# EAGLE design tec_controller (EAGLE 8.5.2)
CREV: 1.0
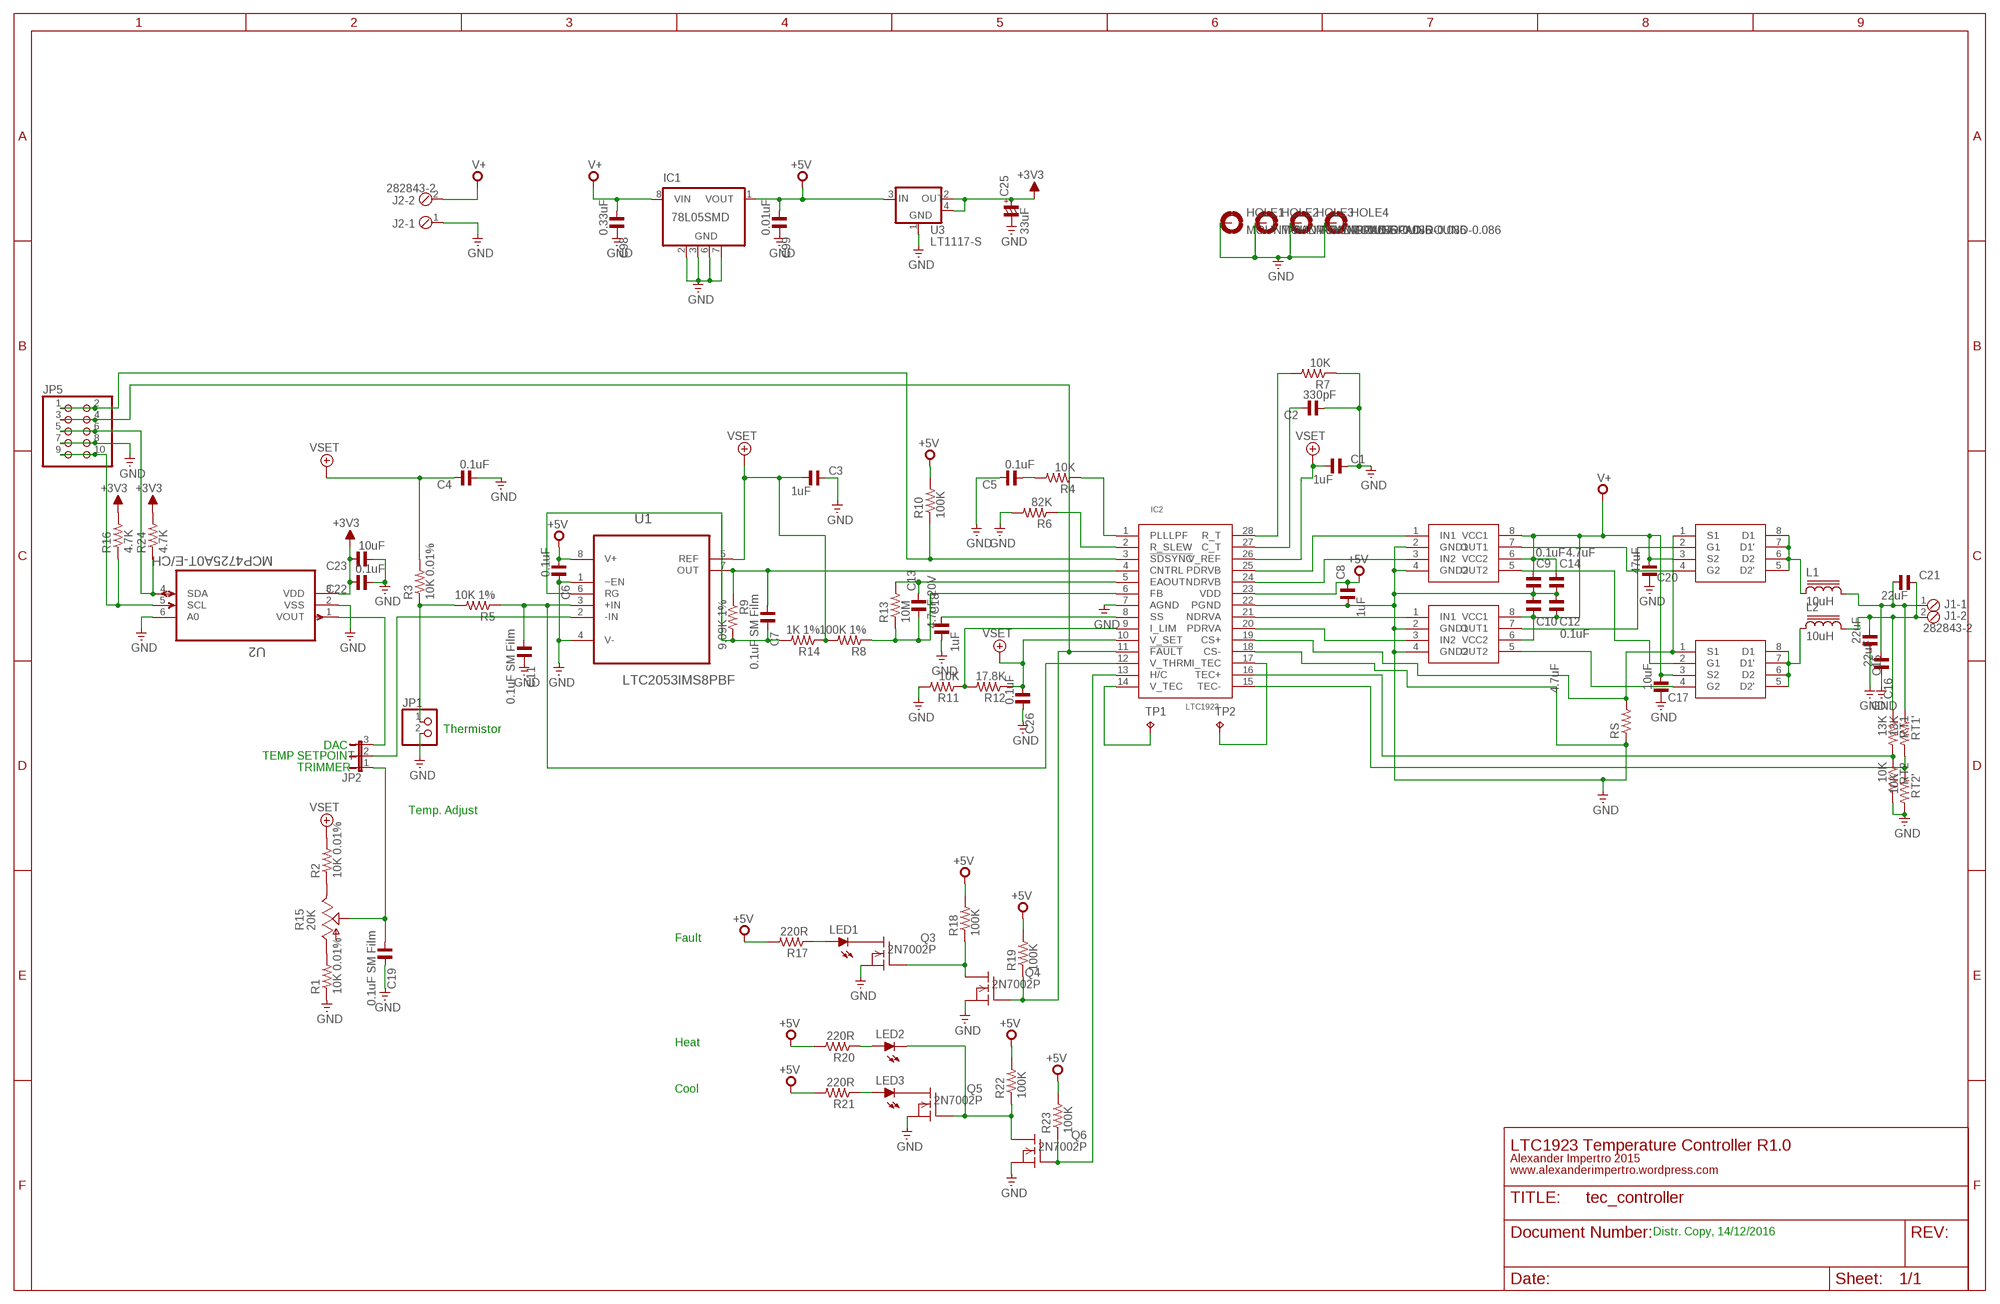
[diagram p0: schematic, sheet 1]
FRAME3 (FRAME_B_L): CREV: 1.0

## Parts
C1  1uF  C-EUC0603  [C0603]
C2  330pF  C-EUC0603  [C0603]
C3  1uF  C-EUC0603  [C0603]
C4  0.1uF  C-EUC0603  [C0603]
C5  0.1uF  C-EUC0603  [C0603]
C6  0.1uF  C-EUC0603  [C0603]
C7  0.1uF SM Film  C-EUC0805  [C0805]
C8  1uF  C-EUC0603  [C0603]
C9  0.1uF  C-EUC0603  [C0603]
C10  4.7uF  C-EUC0603  [C0603]
C11  0.1uF SM Film  C-EUC0805  [C0805]
C12  0.1uF  C-EUC0603  [C0603]
C13  4.7uF 20V  C-EUC1206  [C1206]
C14  4.7uF  C-EUC0603  [C0603]
C15  22uF  C-EUC0603  [C0603]
C16  22uF  C-EUC0603  [C0603]
C17  10uF  C-EUC0603  [C0603]
C18  1uF  C-EUC0603  [C0603]
C19  0.1uF SM Film  C-EUC0805  [C0805]
C20  47uF  C-EUC0805  [C0805]
C21  22uF  C-EUC0603  [C0603]
C22  0.1uF  C-EUC0603  [C0603]
C23  10uF  C-EUC0603  [C0603]
C25  33uF  CPOL-EU153CLV-0505  [153CLV-0505]
C26  0.1uF  C-EUC0603  [C0603]
C98  0.33uF  C-EUC0805  [C0805]
C99  0.01uF  C-EUC0805  [C0805]
HOLE1  MOUNT-PAD-ROUND-0.086  [086-PAD]
HOLE2  MOUNT-PAD-ROUND-0.086  [086-PAD]
HOLE3  MOUNT-PAD-ROUND-0.086  [086-PAD]
HOLE4  MOUNT-PAD-ROUND-0.086  [086-PAD]
IC1  78L05SMD  [SO08]
IC2  LTC1923  [SSOP28]
IC3  LTC1693-1  [SO-08]
IC4  LTC1693-1  [SO-08]
IC5  IRF7343  [SO-08]
IC6  IRF7343  [SO-08]
J1  282843-2  [282843-2]
J2  282843-2  [282843-2]
JP1  PINHD-1X2  [1X02]
JP2  JP2E  [JP2]
JP5  PINHD-2X5  [2X05]
L1  10uH  DRA127  [DRA127]
L2  10uH  DRA127  [DRA127]
LED1  LEDCHIPLED_0805  [CHIPLED_0805]
LED2  LEDCHIPLED_0805  [CHIPLED_0805]
LED3  LEDCHIPLED_0805  [CHIPLED_0805]
Q3  2N7002P  [SOT95P230X110-3N]
Q4  2N7002P  [SOT95P230X110-3N]
Q5  2N7002P  [SOT95P230X110-3N]
Q6  2N7002P  [SOT95P230X110-3N]
R1  10K 0.01%  R-EU_R0603  [R0603]
R2  10K 0.01%  R-EU_R0603  [R0603]
R3  10K 0.01%  R-EU_R0603  [R0603]
R4  10K  R-EU_R0603  [R0603]
R5  10K 1%  R-EU_R0603  [R0603]
R6  82K  R-EU_R0603  [R0603]
R7  10K  R-EU_R0603  [R0603]
R8  100K 1%  R-EU_R0603  [R0603]
R9  9.09K 1%  R-EU_R0603  [R0603]
R10  100K  R-EU_R0805  [R0805]
R11  10K  R-EU_R0603  [R0603]
R12  17.8K  R-EU_R0805  [R0805]
R13  10M  R-EU_R0805  [R0805]
R14  1K 1%  R-EU_R0603  [R0603]
R15  20K  TRIM_US-B25P  [B25P]
R16  4.7K  R-EU_R0603  [R0603]
R17  220R  R-EU_R0603  [R0603]
R18  100K  R-EU_R0603  [R0603]
R19  100K  R-EU_R0603  [R0603]
R20  220R  R-EU_R0603  [R0603]
R21  220R  R-EU_R0603  [R0603]
R22  100K  R-EU_R0603  [R0603]
R23  100K  R-EU_R0603  [R0603]
R24  4.7K  R-EU_R0603  [R0603]
RS  R-EU_R2512  [R2512]
RT1  13K  R-EU_R0603  [R0603]
RT1'  13K  R-EU_R0603  [R0603]
RT2  10K  R-EU_R0603  [R0603]
RT2'  10K  R-EU_R0603  [R0603]
TP1  TPTP10SQ  [TP10SQ]
TP2  TPTP10SQ  [TP10SQ]
U1  LTC2053IMS8PBF  [SOP65P490X110-8N]
U2  MCP4725A0T-E/CH  [SOT95P270X145-6N]
U3  LT1117-S  [SOT223]

## Nets
+3V3: C22.1 C23.1 C25.+ R16.2 R24.2 U2.3(VDD) U3.2(OUT) U3.4(TAB)
+5V: C6.2 C8.1 C99.2 IC1.1(VOUT) IC2.23(VDD) R10.2 R17.2 R18.2 R19.2 R20.2 R21.2 R22.2 R23.2 U1.8(V+) U3.3(IN)
+5V/2: C1.2 C3.2 C4.1 C26.2 IC2.10(V_SET) IC2.26(V_REF) R2.2 R3.2 R8.2 R12.1 R14.1 U1.5(REF) ; supply symbol labelled VSET
GND: C1.1 C2.2 C3.1 C4.2 C5.1 C6.1 C8.2 C9.1 C10.2 C11.1 C12.2 C14.1 C15.1 C16.1 C17.1 C18.2 C19.1 C20.1 C22.2 C23.2 C25.- C26.1 C98.1 C99.1 HOLE1.B086(MOUNT) HOLE2.B086(MOUNT) HOLE3.B086(MOUNT) HOLE4.B086(MOUNT) IC1.2(GND) IC1.3(GND) IC1.6(GND) IC1.7(GND) IC2.7(AGND) IC2.18(CS-) IC2.22(PGND) IC3.2(GND1) IC3.4(GND2) IC4.2(GND1) IC4.4(GND2) J2.1 JP1.2 JP5.7 JP5.8 Q3.2(S) Q4.2(S) Q5.2(S) Q6.2(S) R1.1 R6.2 R7.1 R11.2 RS.1 RT2'.2 RT2.2 U1.1(~EN) U1.4(V-) U2.2(VSS) U2.6(A0) U3.1(GND)
N$1: LED2.C Q5.1(G) Q6.3(D) R22.1
N$2: C2.1 IC2.27(C_T)
N$3: IC2.14(V_TEC) TP1.TP
N$4: IC2.17(I_TEC) TP2.TP
N$5: IC2.13(H/C) Q6.1(G) R23.1
N$6: IC2.28(R_T) R7.2
N$7: LED3.C Q5.3(D)
N$8: LED2.A R20.1
N$9: LED3.A R21.1
N$10: IC2.11(!FAULT) JP5.3 JP5.4 Q4.1(G) R19.1
N$11: Q3.1(G) Q4.3(D) R18.1
N$12: LED1.C Q3.3(D)
N$13: LED1.A R17.1
N$14: C7.2 IC2.4(CNTRL) R9.1 U1.7(OUT)
N$15: C11.2 IC2.12(V_THRM) R5.1 U1.3(+IN)
N$16: JP1.1 R3.1 R5.2
N$17: C7.1 R9.2 R14.2 U1.6(RG)
N$18: JP2.2 U1.2(-IN)
N$19: R1.2 R15.A
N$20: R2.1 R15.E
N$21: IC2.9(I_LIM) R11.1 R12.2
N$22: IC2.2(R_SLEW) R6.1
N$23: JP2.3 U2.1(VOUT)
N$24: C18.1 IC2.8(SS)
N$25: C5.2 R4.2
N$26: IC2.1(PLLLPF) R4.1
N$27: C13.2 IC2.6(FB) R8.1 R13.1
N$28: C13.1 IC2.5(EAOUT) R13.2
N$29: C19.2 JP2.1 R15.S
N$31: IC2.16(TEC+) RT1.2 RT2.1
N$32: IC2.25(PDRVB) IC3.1(IN1)
N$33: IC2.24(NDRVB) IC3.3(IN2)
N$34: IC2.21(NDRVA) IC4.1(IN1)
N$35: IC2.20(PDRVA) IC4.3(IN2)
N$36: IC2.15(TEC-) RT1'.2 RT2'.1
N$37: IC2.3(!SDSYNC) JP5.1 JP5.2 R10.1
N$39: IC2.19(CS+) IC5.1(S1) IC6.1(S1) RS.2
N$40: IC4.7(OUT1) IC5.2(G1)
N$42: IC3.7(OUT1) IC5.4(G2)
N$43: IC3.5(OUT2) IC6.2(G1)
N$44: C16.2 C21.2 J1.1 L1.2 RT1'.1
N$45: C15.2 C21.1 J1.2 L2.2 RT1.1
N$48: IC5.5(D2') IC5.6(D2) IC5.7(D1') IC5.8(D1) L1.1
N$49: IC6.5(D2') IC6.6(D2) IC6.7(D1') IC6.8(D1) L2.1
N$50: JP5.5 JP5.6 R24.1 U2.4(SDA)
N$51: JP5.9 JP5.10 R16.1 U2.5(SCL)
N$53: IC4.5(OUT2) IC6.4(G2)
V+: C9.2 C10.1 C12.1 C14.2 C17.2 C20.2 C98.2 IC1.8(VIN) IC3.6(VCC2) IC3.8(VCC1) IC4.6(VCC2) IC4.8(VCC1) IC5.3(S2) IC6.3(S2) J2.2
Unconnected: IC1.4(NC) IC1.5(NC)

## Notes on the sheet
- Thermistor
- DAC
- TEMP SETPOINT
- TRIMMER
- Temp. Adjust
- Fault
- Heat
- Cool
- LTC1923 Temperature Controller R1.0
- Alexander Impertro 2015
- www.alexanderimpertro.wordpress.com
- Distr. Copy, 14/12/2016

## Library data of the parts
C1-C23 C26 C98 C99 = rcl:C-EU: CAPACITOR, European symbol
C25 = rcl:CPOL-EU: POLARIZED CAPACITOR, European symbol
HOLE1-HOLE4 = holes:MOUNT-PAD-ROUND-: MOUNTING PAD, round; BOM: EXCLUDE
IC1 = linear:78L*SMD: Positive VOLTAGE REGULATOR
IC2 = LTC1923:LTC1923
IC3 IC4 = LTC1693-1:LTC1693-1
IC5 IC6 = IRF7343:IRF7343
J1 J2 = con-tyco:282843-2: TERMINAL BLOCK Buchanan, Euro Style
JP1 = pinhead:PINHD-1X2: PIN HEADER
JP2 = jumper:JP2E: JUMPER
JP5 = pinhead:PINHD-2X5: PIN HEADER
L1 L2 = inductor-cooper:DRA127: POWER INDUCTOR
LED1-LED3 = led:LED: LED Various Types
Q3-Q6 = NXP_By_element14_Batch_1:2N7002P: MOSFET; MPN: 2N7002P; OC_FARNELL: 1859848; OC_NEWARK: 28T0307; PACKAGE: SOT-23-3; SUPPLIER: NXP
R1-R14 R16-R24 RS RT1 RT1' RT2 RT2' = rcl:R-EU_: RESISTOR, European symbol
R15 = pot:TRIM_US-: POTENTIOMETER
TP1 TP2 = testpad:TP: Test pad
U1 = LTC_By_element14_Batch_1:LTC2053IMS8PBF: Precision, Rail-to-Rail,Zero-Drift, Resistor-Programmable Instrumentation Amplifier; MPN: LTC2053IMS8#PBF; OC_FARNELL: 1663681; OC_NEWARK: 56M4734; PACKAGE: MSOP-8; SUPPLIER: Linear Technology
U2 = Microchip_By_element14_Batch_1:MCP4725A0T-E/CH: 12-Bit Digital-to-Analog Converter with EEPROM; MPN: MCP4725A0T-E/CH; OC_FARNELL: 1578449; OC_NEWARK: 77M3032; PACKAGE: SOT-23-6; SUPPLIER: Microchip
U3 = v-reg:LT1117: 800mA LDO Positive Regulator Fixed 2.85V, 3.3V, 5V

## Board
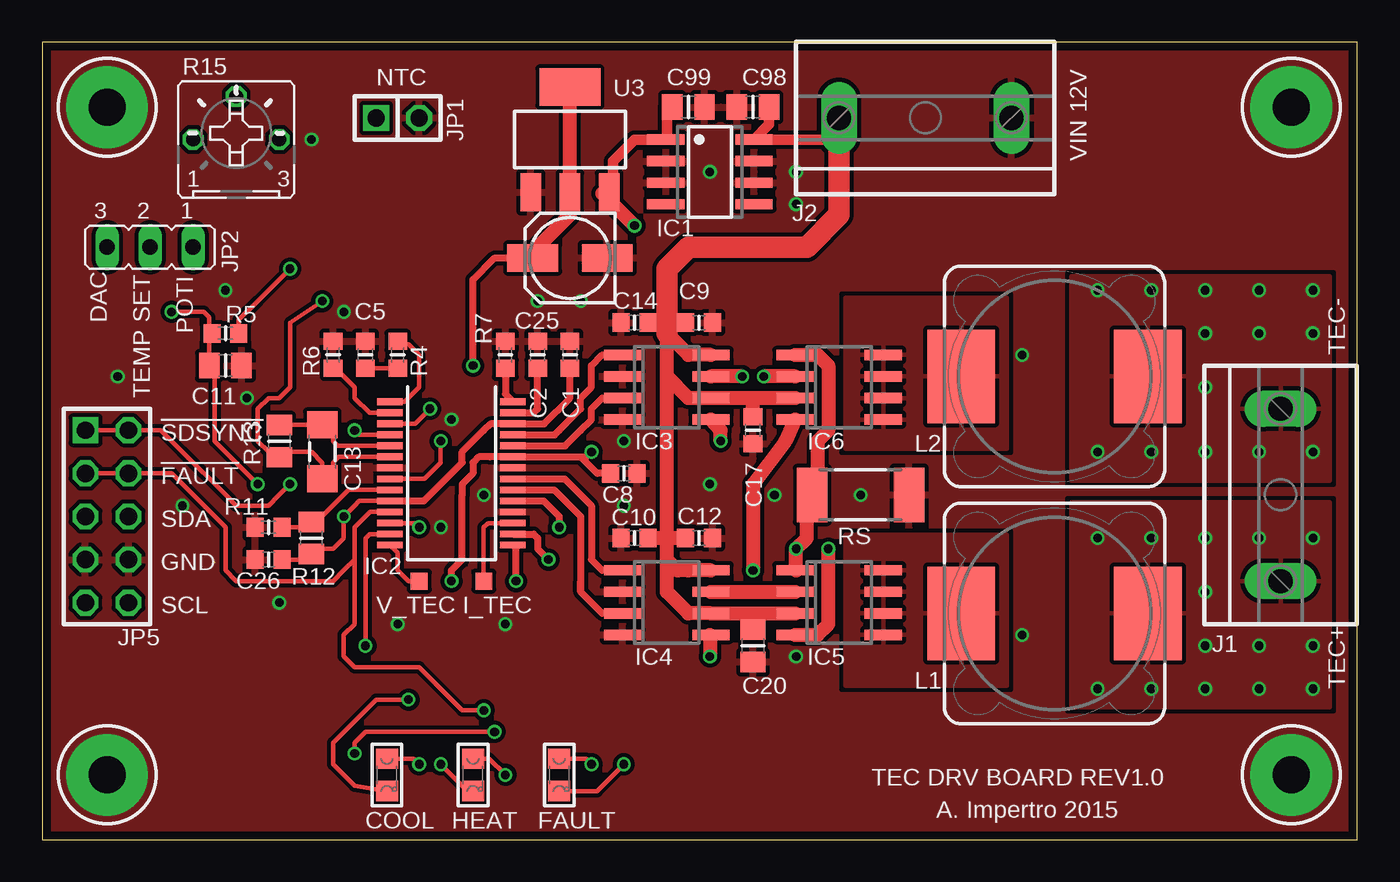
[diagram p1: board, top side]
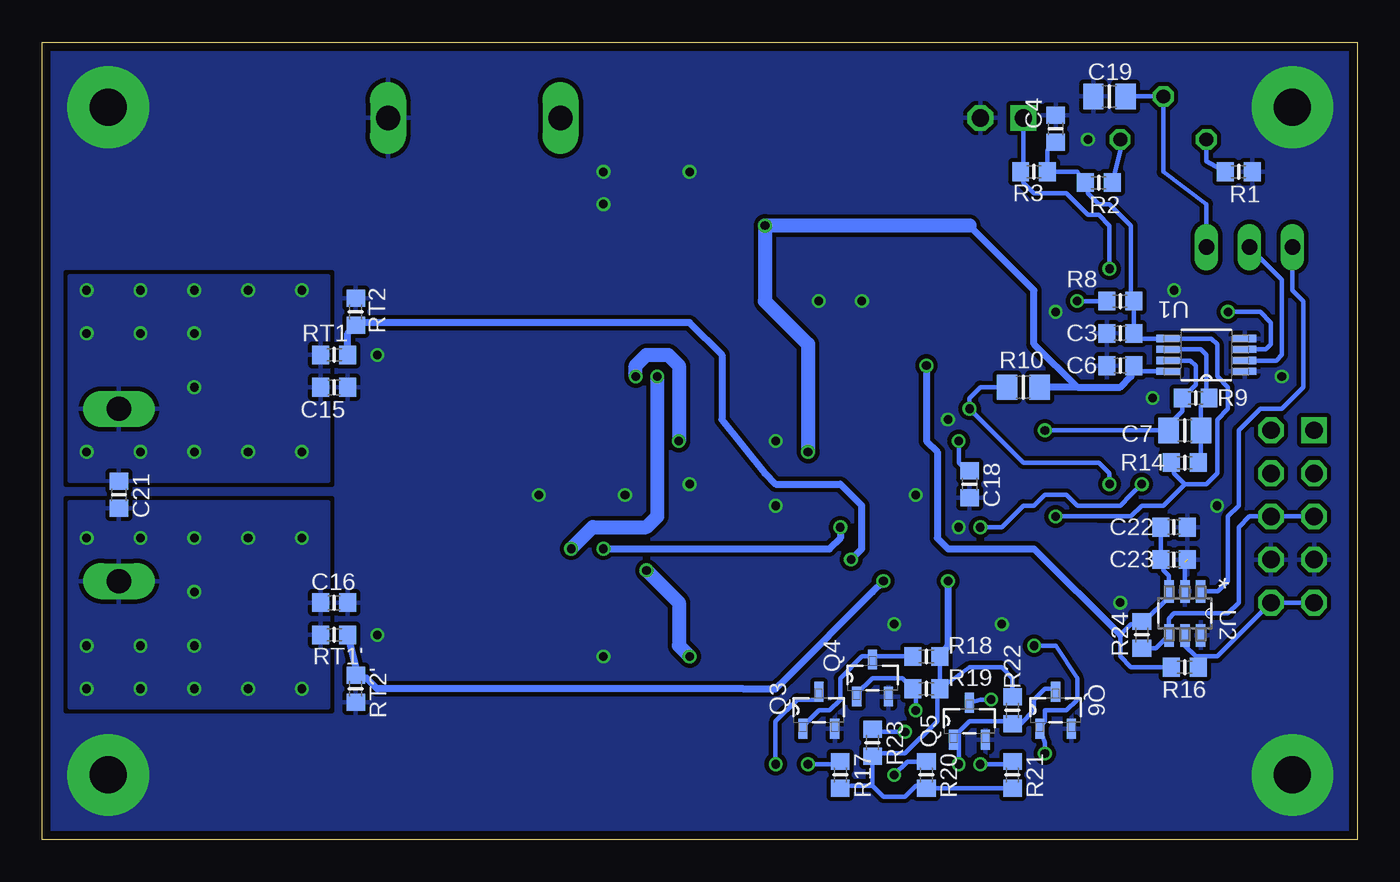
[diagram p2: board, bottom side, seen from below]

Size 77.54 x 47 mm. Coordinates in mm from the lower left corner, seen from the top.
Outline: 0,0 77.54,0 77.54,47 0,47 0,0
Copper layers (1*16): Top 0.035mm / dielectric 1.6mm / Bottom 0.035mm
Design rules "Elecrow_2-layer_PCB_eagle_rule": minimum track width 6mil, minimum drill 12mil, track to track 6mil, track to pad 6mil, pad to pad 6mil, via to via 8mil, smd to smd 0mil, copper to edge 20mil, drill to drill 10mil, minimum pad ring 6mil, minimum via ring 6mil, stop-mask expansion 0mil, vias tented up to drill 100mil, thermal gap 10mil

### Footprints (pad centres in the part's own frame; a part is rotated, then mirrored left to right if it is on the bottom)
C0603 = smd 1 x 1.1: 1 -0.794,0; 2 0.794,0
C0805 = smd 1.2 x 1.5: 1 -0.953,0; 2 0.953,0
C1206 = smd 1.6 x 1.8: 1 -1.587,0; 2 1.587,0
153CLV-0505 = smd 3 x 1.6: + 2.2,0; - -2.2,0
086-PAD = drill 2.184 pad 4.826: B086 0,0
SO08 = smd 0.6 x 2.2: 1 -1.905,-2.6; 2 -0.635,-2.6; 3 0.635,-2.6; 4 1.905,-2.6; 5 1.905,2.6; 6 0.635,2.6; 7 -0.635,2.6; 8 -1.905,2.6
SSOP28 = smd 0.4 x 1.5: 1 -4.225,-3.625; 2 -3.575,-3.625; 3 -2.925,-3.625; 4 -2.275,-3.625; 5 -1.625,-3.625; 6 -0.975,-3.625; 7 -0.325,-3.625; 8 0.325,-3.625; 9 0.975,-3.625; 10 1.625,-3.625; 11 2.275,-3.625; 12 2.925,-3.625; 13 3.575,-3.625; 14 4.225,-3.625; 15 4.225,3.625; 16 3.575,3.625; 17 2.925,3.625; 18 2.275,3.625; 19 1.625,3.625; 20 0.975,3.625; 21 0.325,3.625; 22 -0.325,3.625; 23 -0.975,3.625; 24 -1.625,3.625; 25 -2.275,3.625; 26 -2.925,3.625; 27 -3.575,3.625; 28 -4.225,3.625
SO-08 = smd 0.6 x 2.2: 1 -1.905,-2.6; 2 -0.635,-2.6; 3 0.635,-2.6; 4 1.905,-2.6; 5 1.905,2.6; 6 0.635,2.6; 7 -0.635,2.6; 8 -1.905,2.6
282843-2 = drill 1.422 long: 1 -5.08,0; 2 5.08,0
1X02 = drill 1.016 square: 1 -1.27,0 | drill 1.016 octagon: 2 1.27,0
JP2 = drill 0.914 long: 1 -2.54,0; 2 0,0; 3 2.54,0
2X05 = drill 1.016 square: 1 -5.08,-1.27 | drill 1.016 octagon: 2 -5.08,1.27; 3 -2.54,-1.27; 4 -2.54,1.27; 5 0,-1.27; 6 0,1.27; 7 2.54,-1.27; 8 2.54,1.27; 9 5.08,-1.27; 10 5.08,1.27
DRA127 = smd 4 x 5.5: 1 -5.5,0; 2 5.5,0
CHIPLED_0805 = smd 1.3 x 1.2: A 0,-0.953; C 0,0.953
SOT95P230X110-3N = smd 1.168 x 0.533: 1 -1.092,0.94; 2 -1.092,-0.94; 3 1.092,0
R0603 = smd 1 x 1.1: 1 -0.794,0; 2 0.794,0
R0805 = smd 1.2 x 1.5: 1 -0.953,0; 2 0.953,0
B25P = drill 0.813 octagon: A -2.54,0; E 2.54,0; S 0,2.54
R2512 = smd 1.8 x 3.2: 1 -2.857,0; 2 2.857,0
TP10SQ = smd 1 x 1: TP 0,0
SOP65P490X110-8N = smd 1.397 x 0.432: 1 -2.261,0.965; 2 -2.261,0.33; 3 -2.261,-0.33; 4 -2.261,-0.965; 5 2.261,-0.965; 6 2.261,-0.33; 7 2.261,0.33; 8 2.261,0.965
SOT95P270X145-6N = smd 1.321 x 0.559: 1 -1.295,0.94; 2 -1.295,0; 3 -1.295,-0.94; 4 1.295,-0.94; 5 1.295,0; 6 1.295,0.94
SOT223 = smd 1.219 x 2.235: 1 -2.311,-3.099; 2 0,-3.099; 3 2.311,-3.099 | smd 3.6 x 2.2: 4 0,3.099

### Placement (x,y rotation side)
C1  31.11,28.57 270 top
C2  29.21,28.57 90 top
C3  13.97,29.84 0 bottom
C4  17.78,41.91 90 bottom
C5  19.05,28.57 270 top
C6  13.97,27.94 0 bottom
C7  10.16,24.13 180 bottom
C8  34.29,21.59 0 top
C9  38.73,30.48 180 top
C10  34.92,17.78 180 top
C11  10.79,27.94 180 top
C12  38.73,17.78 0 top
C13  16.51,22.86 270 top
C14  34.92,30.48 0 top
C15  60.33,26.67 180 bottom
C16  60.33,13.97 180 bottom
C17  41.91,24.13 90 top
C18  22.86,20.95 270 bottom
C19  14.61,43.81 0 bottom
C20  41.91,11.43 90 top
C21  73.03,20.32 270 bottom
C22  10.79,18.41 0 bottom
C23  10.79,16.51 0 bottom
C25  31.11,34.29 180 top
C26  13.34,16.51 0 top
C98  41.91,43.18 0 top
C99  38.1,43.18 180 top
HOLE1  3.81,3.81 0 top
HOLE2  73.66,43.18 0 top
HOLE3  3.81,43.18 0 top
HOLE4  73.66,3.81 0 top
IC1  39.37,39.37 270 top
IC2  24.13,21.59 270 top
IC3  36.83,26.67 270 top
IC4  36.83,13.97 270 top
IC5  46.99,13.97 270 top
IC6  46.99,26.67 270 top
J1  73.03,20.32 90 top
J2  52.07,42.55 180 top
JP1  20.95,42.55 0 top
JP2  6.35,34.92 180 top
JP5  3.81,19.05 270 top
L1  59.69,13.34 0 top
L2  59.69,27.3 0 top
LED1  30.48,3.81 180 top
LED2  25.4,3.81 180 top
LED3  20.32,3.81 180 top
Q3  31.75,7.62 90 bottom
Q4  28.57,9.53 90 bottom
Q5  22.86,6.99 90 bottom
Q6  17.78,7.62 90 bottom
R1  6.99,39.37 180 bottom
R2  15.24,38.73 180 bottom
R3  19.05,39.37 0 bottom
R4  20.95,28.57 270 top
R5  10.79,29.84 0 top
R6  17.14,28.57 90 top
R7  27.3,28.57 270 top
R8  13.97,31.75 0 bottom
R9  9.53,26.04 0 bottom
R10  19.68,26.67 0 bottom
R11  13.34,18.41 180 top
R12  15.88,17.78 90 top
R13  13.97,23.5 90 top
R14  10.16,22.23 0 bottom
R15  11.43,41.27 0 top
R16  10.16,10.16 180 bottom
R17  30.48,3.81 270 bottom
R18  25.4,10.79 0 bottom
R19  25.4,8.89 0 bottom
R20  25.4,3.81 270 bottom
R21  20.32,3.81 270 bottom
R22  20.32,7.62 90 bottom
R23  28.57,5.71 270 bottom
R24  12.7,12.06 90 bottom
RS  48.26,20.32 180 top
RT1  60.33,28.57 0 bottom
RT1'  60.33,12.06 0 bottom
RT2  59.05,31.11 90 bottom
RT2'  59.05,8.89 270 bottom
TP1  22.23,15.24 0 top
TP2  26.04,15.24 0 top
U1  8.89,28.57 180 bottom
U2  10.16,13.34 270 bottom
U3  31.11,41.27 0 top

### Tracks (layer width: path | path; a pad name or v marks a point on that pad's centre or on a via)
+3V3  (via drill 0.51)
  Top 0.406: v25.4,27.94 25.4,33.02 26.67,34.29 C25.+
  Top 0.61: 29.21,34.92 C25.+
  Top 0.813: 29.21,34.92 31.11,36.83 U3.2 U3.4
  Bottom 0.254: R16.2 13.34,10.16 13.97,10.79 13.97,12.06 13.34,12.7 12.86,12.7 R24.2 12.54,12.86 11.1,14.3 U2.3 11.1,15.54 11.43,15.88 11.43,16.35 C23.1 C22.1
  Bottom 0.406: v25.4,27.94 25.4,23.5 24.77,22.86 24.77,17.78 24.13,17.14 19.05,17.14 13.97,12.06
+5V  (via drill 0.51)
  Top 0.406: 31.75,22.57 IC2.23 26.38,22.57 25.74,22.57 25.4,22.23 25.4,21.59 24.77,20.95 24.77,20.32 24.77,16.51 24.13,15.88 v24.13,15.24 | 31.75,22.57 32.09,22.57 v32.38,22.86 | C8.1 32.73,21.59 31.75,22.57
  Top 0.61: C99.2 36.83,43.18 36.83,41.27 IC1.1 34.92,41.27 33.66,40.01 33.66,38.73 U3.3 33.02,38.1
  Top 0.813: 33.02,38.1 v34.92,36.2
  Bottom 0.254: R21.2 R20.2 26.04,3.17 26.67,2.54 27.94,2.54 28.57,3.17 | R17.2 29.84,3.17 28.57,3.17 | R18.2 R19.2 | R22.2 20.32,9.53 20.95,10.16 22.86,10.16 R19.2 | R19.2 24.77,8.89 24.77,6.99 26.67,5.08 27.94,5.08 R23.2 28.57,3.17 | U1.8 12.85,27.61 C6.2
  Bottom 0.406: v24.13,15.24 24.13,11.43 R18.2 | 22.86,36.2 19.05,32.38 19.05,29.21 16.51,26.67 | 16.51,26.67 13.97,26.67 13.34,27.3 13.34,27.78 C6.2 | 16.51,26.67 18.1,26.67 R10.2
  Bottom 0.813: v32.38,22.86 32.38,29.21 34.92,31.75 v34.92,36.2 22.86,36.2
+5V/2  (via drill 0.51)
  Top 0.254: IC2.10 18.7,19.96 18.41,19.68 18.1,19.37 | 18.1,19.37 v17.78,19.05 | v17.78,19.05 18.1,19.37 | C26.2 15.56,16.51 R12.1 16.19,17.14 17.14,17.14 17.78,17.78 v17.78,19.05
  Top 0.406: C1.2 31.11,26.04 29.59,24.52 IC2.26 26.42,24.52 26.04,24.13 24.77,22.86 24.77,22.23 23.5,20.95 22.86,20.32 22.5,19.96 21.87,19.96 IC2.10
  Bottom 0.254: 10.16,20.95 8.89,20.95 8.26,21.59 8.26,24.77 7.62,25.4 7.62,26.67 8.26,27.3 8.26,29.21 8.59,29.54 U1.5 12.87,29.54 C3.2 R8.2 13.34,31.91 13.34,36.2 14.61,37.47 15.24,37.47 15.88,38.1 15.88,38.73 R2.2 16.51,39.37 R3.2 18.26,40.64 C4.1 | 10.16,20.95 10.79,21.59 10.79,22.07 R14.1 | 10.16,20.95 11.43,19.68 12.7,19.68 13.34,19.05 15.24,19.05 v17.78,19.05
GND  (via drill 0.51)  (1 unrouted)
  Bottom 0.254: U2.2 10.16,16.35
  other vias: 39.37,20.95 43.18,20.32 12.06,26.04 34.29,19.68 34.29,23.5 8.26,19.68 27.3,12.7 4.45,27.3 15.88,41.27 10.79,32.38 24.13,24.77 26.04,20.32 23.5,18.41 13.97,13.97 44.45,10.79 31.75,31.75 44.45,37.47 44.45,39.37 29.21,31.75 17.78,31.11 20.95,12.7 48.26,20.32 57.78,28.57 57.78,12.06 39.37,39.37
  pour Top (isolate 0.241, rank 3): -5,49.84 82.14,49.84 82.14,-2.46 -5,-2.46
  pour Bottom (isolate 0.254, rank 3): -5.08,50.45 82.55,50.45 82.55,-2.54 -5.08,-2.54
N$1  (via drill 0.51)
  Top 0.254: LED2.C 25.08,2.86 v23.5,4.45
  Bottom 0.254: v23.5,4.45 23.5,5.71 | 23.5,5.71 Q5.1 | 23.5,5.71 23.5,6.35 22.86,6.99 20.32,6.99 R22.1 19.84,6.83 19.05,7.62 19.05,8.26 18.41,8.89 17.96,8.89 Q6.3
N$2
  Top 0.406: IC2.27 28.98,25.16 29.21,25.4 C2.1
N$3
  Top 0.254: TP1.TP 21.59,15.24 20.95,15.88 20.95,16.91 IC2.14
N$4
  Top 0.254: IC2.17 26.29,18.66 26.04,18.41 TP2.TP
N$5  (via drill 0.51)
  Top 0.254: v18.41,5.08 18.41,5.71 19.05,6.35 v26.67,6.35 | IC2.13 19.29,18.02 19.05,17.78 v19.05,11.43
  Bottom 0.254: v18.41,5.08 18.41,5.71 Q6.1 18.41,6.99 18.41,7.62 17.14,7.62 16.51,8.26 16.51,9.53 17.78,11.43 v19.05,11.43 | v26.67,6.35 27.94,6.35 R23.1
N$6
  Top 0.406: R7.2 27.3,27.3 27.3,26.27 IC2.28
N$7  (via drill 0.51)
  Top 0.254: 20.32,3.17 LED3.C 18.41,3.17 17.14,4.45 17.14,5.71 19.68,8.26 v21.59,8.26
  Bottom 0.254: Q5.3 22.23,8.26 v21.59,8.26
N$8  (via drill 0.51)
  Top 0.254: LED2.A 26.35,4.76 v27.3,3.81
  Bottom 0.254: R20.1 26.51,4.6 v27.3,3.81
N$9  (via drill 0.51)
  Top 0.254: 20.32,4.45 LED3.A 21.91,4.76 v22.23,4.45
  Bottom 0.254: v22.23,4.45 20.32,4.45 R21.1
N$10  (via drill 0.51)
  Top 0.254: v26.04,7.62 24.77,7.62 22.23,10.16 19.05,10.16 18.41,10.16 17.78,10.79 17.78,11.43 17.78,12.06 18.41,12.7 18.41,16.51 | JP5.3 JP5.4 5.71,21.59 7.62,21.59 10.79,18.41 10.79,16.51 10.79,15.88 11.43,15.24 17.14,15.24 17.78,15.88 18.41,16.51 | IC2.11 19.32,19.32 18.41,18.41 18.41,16.51
  Bottom 0.254: v26.04,7.62 26.04,8.89 R19.1 26.83,9.53 28.57,9.53 29.52,8.59 Q4.1
N$11
  Bottom 0.254: Q3.1 32.38,6.99 31.75,7.62 31.11,7.62 30.48,8.26 30.48,9.53 29.21,10.79 28.75,10.79 Q4.3 28.4,10.79 27.94,10.79 R18.1
N$12  (via drill 0.51)
  Top 0.254: LED1.C 32.7,2.86 v34.29,4.45
  Bottom 0.254: v34.29,4.45 34.29,6.99 33.02,8.26 31.75,8.26 Q3.3
N$13  (via drill 0.51)
  Top 0.254: LED1.A 32.07,4.76 v32.38,4.45
  Bottom 0.254: v32.38,4.45 30.48,4.45 R17.1
N$14  (via drill 0.51)
  Top 0.254: IC2.4 18.68,23.86 v18.41,24.13
  Bottom 0.254: U1.7 9.83,28.25 9.53,27.94 9.53,26.83 R9.1 10.32,25.24 10.79,24.77 10.79,24.45 C7.2 v18.41,24.13
N$15  (via drill 0.51)
  Top 0.254: v12.7,20.95 10.16,23.5 10.16,27.62 C11.2 9.84,29.69 | 9.84,29.69 R5.1 | 9.84,29.69 9.84,30.8 9.53,31.11 v7.62,31.11 | IC2.12 21.98,18.66 v22.23,18.41
  Bottom 0.254: U1.3 5.38,28.91 5.08,29.21 5.08,30.48 5.71,31.11 v7.62,31.11 | v22.23,18.41 21.59,18.41 20.95,18.41 19.68,19.68 19.05,19.68 18.41,20.32 17.14,20.32 16.51,19.68 13.97,19.68 13.34,20.32 v12.7,20.95
N$16  (via drill 0.51)
  Top 0.254: R5.2 11.59,30.64 12.7,31.75 v14.61,33.66
  Bottom 0.254: JP1.1 19.68,40.01 R3.1 19.68,39.37 19.68,38.73 19.05,38.1 17.14,38.1 16.51,37.47 15.88,36.83 15.24,36.83 14.61,36.2 v14.61,33.66
N$17
  Bottom 0.254: U1.6 9.22,28.91 8.89,28.57 8.89,26.19 R9.2 9.21,25.56 C7.1 9.21,22.38 R14.2
N$18
  Bottom 0.254: JP2.2 5.08,33.66 4.45,33.02 4.45,29.21 4.45,28.57 4.78,28.25 5.41,28.25 U1.2
N$19
  Bottom 0.254: R15.A 8.89,40.01 R1.2
N$20
  Bottom 0.254: R2.1 13.97,40.64 R15.E
N$21
  Top 0.254: IC2.9 18.07,20.61 17.78,20.32 16.51,19.05 16.19,19.05 | 16.19,19.05 R12.2 | 16.19,19.05 R12.2 | R11.1 15.56,18.41 R12.2
N$22
  Top 0.254: IC2.2 19.29,25.16 18.41,26.04 18.41,26.67 17.78,27.3 17.3,27.78 R6.1
N$23
  Bottom 0.254: U2.1 8.23,14.63 7.62,15.24 7.62,19.05 6.99,19.68 6.99,24.13 5.71,25.4 4.45,25.4 3.17,26.67 3.17,31.75 3.81,32.38 JP2.3
N$24  (via drill 0.51)
  Top 0.254: IC2.8 21.9,21.27 22.38,21.27 22.54,21.27 23.5,22.23 v23.5,23.5
  Bottom 0.254: C18.1 23.02,21.75 23.5,22.23 v23.5,23.5
N$25
  Top 0.254: C5.2 R4.2
N$26
  Top 0.254: IC2.1 21.37,25.82 22.23,26.67 22.23,28.57 21.59,29.21 21.11,29.21 R4.1
N$27  (via drill 0.51)
  Top 0.254: 13.97,22.86 15.88,22.86 16.51,22.23 C13.2 16.51,21.59 17.14,21.59 17.14,22.23 17.48,22.57 IC2.6 | 13.97,22.86 R13.1 | 13.97,22.86 13.34,22.86 12.7,23.5 12.7,25.4 13.34,26.04 13.97,26.04 14.61,26.67 14.61,27.94 14.61,30.48 v16.51,31.75
  Bottom 0.254: v16.51,31.75 R8.1
N$28
  Top 0.254: R13.2 C13.1 16.51,24.13 17.14,24.13 17.14,23.5 17.43,23.21 IC2.5
N$29
  Bottom 0.254: JP2.1 8.89,37.47 11.43,39.37 R15.S C19.2
N$31  (via drill 0.51)
  Top 0.406: IC2.16 28.98,18.02 29.21,17.78 29.21,17.14 v29.84,16.51
  Bottom 0.406: v29.84,16.51 29.21,17.14 29.21,19.68 30.48,20.95 34.29,20.95 34.92,21.59 37.47,24.77 37.47,28.57 39.37,30.48 59.05,30.48 RT2.1 59.53,29.84 RT1.2
N$32
  Top 0.406: IC3.1 33.02,28.57 32.38,27.94 32.38,26.67 31.75,26.04 31.75,25.4 30.48,24.13 30.21,23.86 IC2.25
N$33
  Top 0.406: IC3.3 33.02,26.04 32.38,25.4 32.38,24.77 31.75,24.13 30.84,23.21 IC2.24
N$34
  Top 0.406: IC4.1 33.02,15.88 32.38,16.51 32.38,19.68 31.11,20.95 30.8,21.27 30.17,21.27 IC2.21
N$35
  Top 0.406: IC4.3 33.02,13.34 31.75,14.61 | 31.75,14.61 31.75,15.24 | IC2.20 29.55,20.61 30.18,20.61 31.11,19.68 31.75,19.05 31.75,16.51 31.75,14.61
N$36  (via drill 0.51)
  Top 0.406: 27.75,17.33 IC2.15 27.94,17.18 v27.94,15.24
  Bottom 0.406: RT1'.2 59.05,10.16 RT2'.1 58.42,9.53 57.78,8.89 36.2,8.89 34.29,8.89 33.66,9.53 28.57,14.61 v27.94,15.24
N$37  (via drill 0.51)
  Top 0.254: v14.61,20.95 13.97,20.32 13.34,19.68 11.43,19.68 10.79,20.32 8.26,22.86 6.99,24.13 JP5.2 JP5.1 | IC2.3 21.98,24.52 v22.86,25.4
  Bottom 0.254: R10.1 22.23,26.67 22.86,26.04 v22.86,25.4 19.68,22.23 15.24,22.23 14.61,21.59 v14.61,20.95
N$39  (via drill 0.51)
  Top 0.406: 44.45,15.88 IC5.1 | IC2.19 28.93,19.96 29.57,19.96 29.84,19.68 30.48,19.05 v30.48,18.41
  Top 0.813: IC6.1 45.72,28.57 46.35,27.94 46.35,24.13 45.72,23.5 45.72,20.95 RS.2 45.09,20.32 45.09,17.78 v44.45,17.14 44.45,15.88
  Bottom 0.406: v44.45,17.14 31.11,17.14 30.48,17.78 v30.48,18.41
N$40
  Top 0.813: IC4.7 IC5.2
N$42  (via drill 0.51)
  Top 0.813: IC5.4 45.72,12.06 46.35,12.7 v46.35,17.14 | v41.27,27.3 IC3.7
  Bottom 0.813: v46.35,17.14 45.09,18.41 41.91,18.41 41.27,19.05 v41.27,27.3
N$43  (via drill 0.51)
  Top 0.813: IC6.2 v42.55,27.3 | v40.01,23.5 40.01,24.13 IC3.5
  Bottom 0.813: v42.55,27.3 42.55,27.94 41.91,28.57 40.64,28.57 40.01,27.94 v40.01,23.5
N$44  (via drill 0.51)
  other vias: 74.93,8.89 71.75,8.89 68.58,8.89 65.41,8.89 74.93,17.78 71.75,17.78 68.58,17.78 65.41,17.78 74.93,11.43 68.58,11.43 71.75,11.43 68.58,14.61 62.23,8.89 62.23,17.78
  pour Top: 60.69,19.88 75.93,19.88 75.93,7.81 60.69,7.81
  pour Bottom: 60.69,19.88 75.93,19.88 75.93,7.81 60.69,7.81
N$45  (via drill 0.51)
  other vias: 62.23,22.86 65.41,22.86 68.58,22.86 71.75,22.86 74.93,22.86 74.93,32.38 68.58,32.38 65.41,32.38 62.23,32.38 71.75,32.38 71.75,29.84 74.93,29.84 68.58,29.84 68.58,26.67
  pour Top: 60.69,33.21 75.93,33.21 75.93,21.14 60.69,21.14
  pour Bottom: 60.69,33.21 75.93,33.21 75.93,21.14 60.69,21.14
N$48
  pour Top: 56.88,17.97 47.35,17.97 47.35,9.08 56.88,9.08
N$49
  pour Top: 47.35,31.94 56.88,31.94 56.88,23.05 47.35,23.05
N$50
  Bottom 0.254: JP5.5 JP5.6 6.35,19.05 6.99,18.41 6.99,13.97 7.62,13.34 10.79,13.34 11.1,13.03 U2.4 11.87,11.27 R24.1
N$51
  Bottom 0.254: JP5.9 JP5.10 8.26,10.79 9.53,10.79 | R16.1 9.37,10.64 9.53,10.79 | 9.53,10.79 10.16,11.43 | 10.16,11.43 U2.5 10.16,11.43 | 10.16,11.43 9.53,10.79
N$53  (via drill 0.51)
  Top 0.406: 39.37,12.06 IC4.5
  Top 0.813: IC6.4 43.81,23.5 41.91,20.95 v41.91,15.88 | 39.37,12.06 v39.37,10.79
  Bottom 0.813: v41.91,15.88 40.01,13.97 40.01,11.43 v39.37,10.79
V+
  Top 0.61: C14.2 36.83,30.48 C9.2 | 46.99,41.91 46.35,41.27 43.18,41.27 IC1.8 42.86,42.17 C98.2
  Top 0.813: 41.91,13.34 IC4.6 38.1,13.34 36.83,14.61 36.83,16.51 | 41.91,13.34 IC5.3 | C20.2 41.91,13.34 | IC4.8 38.1,15.88 37.47,15.88 36.83,16.51 | IC3.8 38.1,28.57 36.83,29.84 36.83,27.3 | 36.83,27.3 38.1,26.04 IC3.6 41.91,26.04 | IC6.3 41.91,26.04 | C17.2 41.91,26.04 | 36.83,16.51 36.83,17.78 | 36.83,17.78 36.83,27.3 | C12.1 36.83,17.78 | 36.83,17.78 C10.1
  Top 1.27: 36.83,29.84 36.83,30.48 36.83,33.66 38.1,34.92 45.09,34.92 46.99,36.83 46.99,41.91 J2.2

### Text on the board
tPlace: NTC | VIN 12V | DAC | POTI | TEC- | TEMP SET | !SDSYNC | !FAULT | SDA | GND | SCL | V_TEC | I_TEC | TEC+ | TEC DRV BOARD REV1.0 | COOL | HEAT | FAULT | A. Impertro 2015